# Altium schematic sheet Power.SchDoc: Projekt DAC AUPSC 2019
size A4; Date: 4.10.2019; Author: Michal Grzegorzek; SheetNumber: 4; SheetTotal: 4; Model: EM1; PageSetup: Record=PageOptions|CenterHorizontal=True|CenterVertical=True|PrintScale=0.52|XCorrection=1.00|YCorrection=1.00|PrintKind=1|BorderSize=5000000|LeftOffset=0|BottomOffset=0|Orientation=2|PaperLength=4200|PaperWidth=2970|Scale=100|PaperSource=7|PrintQuality=600|MediaType=1|DitherType=10|PaperKind=A3|PrintScaleMode=1
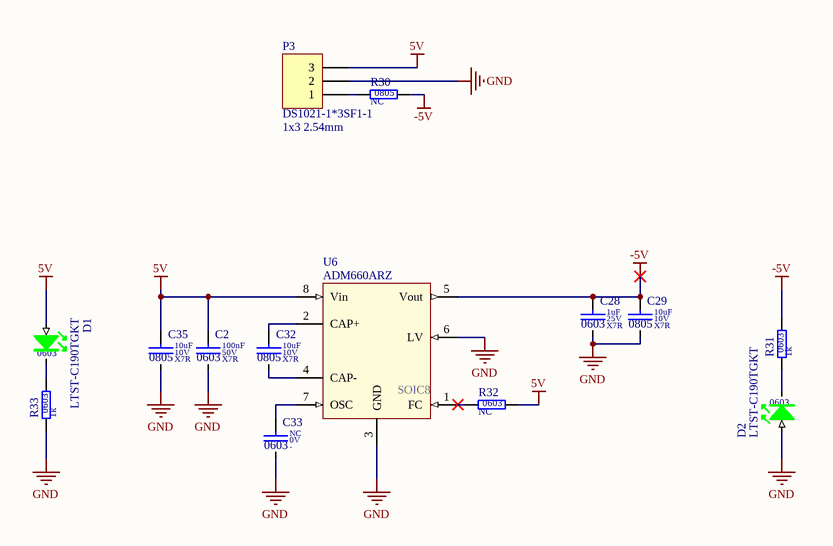
[diagram p0: Power.SchDoc]

## Parts
C2  value 100nF  Dielectric: X7R  Voltage: 50V  SCH_Footprint: 0603  [C_0603_1608]  (hidden comment: Ceramic X7R)
C28  value 1uF  Dielectric: X7R  Voltage: 25V  SCH_Footprint: 0603  [C_0603_1608]  (hidden comment: Ceramic X7R)
C29  value 10uF  Dielectric: X7R  Voltage: 10V  SCH_Footprint: 0805  [C_0805_2012]  (hidden comment: Ceramic X7R)
C32  value 10uF  Dielectric: X7R  Voltage: 10V  SCH_Footprint: 0805  [C_0805_2012]  (hidden comment: Ceramic X7R)
C33  value NC  Voltage: 0V  SCH_Footprint: 0603  [C_NC_0603_1608]  (hidden comment: -)
C35  value 10uF  Dielectric: X7R  Voltage: 10V  SCH_Footprint: 0805  [C_0805_2012]  (hidden comment: Ceramic X7R)
D1  value LTST-C190TGKT  SCH_Footprint: 0603  [OL_0603_1608]  (hidden comment: Green Led)
D2  value LTST-C190TGKT  SCH_Footprint: 0603  [OL_0603_1608]  (hidden comment: Green Led)
P3  value DS1021-1*3SF1-1  SCH_Footprint: 1x3 2.54mm  [P_HEADER_1x3_2.54]  (hidden comment: Goldpin)
R30  value NC  SCH_Footprint: 0805  [R_NC_0805_2012]  (hidden comment: Resistor)
R31  value 1k  SCH_Footprint: 0603  [R_0603_1608]  (hidden comment: Resistor)
R32  value NC  SCH_Footprint: 0603  [R_NC_0603_1608]  (hidden comment: Resistor)
R33  value 1k  SCH_Footprint: 0603  [R_0603_1608]  (hidden comment: Resistor)
U6  value ADM660ARZ  SCH_Footprint: SOIC8  [SOP8_SO8_SOIC8_4X5X18]  (hidden comment: ADM660)

## Nets
5V: C2.1 C35.1 D1.2(A) P3.3 R32.2 U6.8(Vin)
-5V: C28.1 C29.1 R30.2 R31.2 U6.5(Vout)
GND: C2.2 C28.2 C29.2 C33.2 C35.2 D2.2(A) P3.2 R33.1 U6.3(GND) U6.6(LV)
NetC32_1: C32.1 U6.2(CAP+)
NetC32_2: C32.2 U6.4(CAP-)
NetC33_1: C33.1 U6.7(OSC)
NetD1_1: D1.1(K) R33.2
NetD2_1: D2.1(K) R31.1
NetP3_1: P3.1 R30.1
NetR32_1: R32.1 U6.1(FC)

## Notes on the sheet
- Title:
- Sheet:
- of
- Author:
- Model:
- Document Number:
- Checked by:
- Iss-Rev:
- Approved by:
- Date:
- File name:

## Library data of the parts
C2 = C_100nF_50V_X7R_0603_5: Capacitor; Manufacturer: Samsung; Manufacturer Part Number: CL10B104JB8NNNC; Tolerance (%): 5; Part Number: C_100nF_50V_X7R_0603_5; HelpURL: http://www.tme.eu/pl/Document/4a42202b32dab16128fe107dd69598cc/samsung-chip-cap.pdf; Supplier 1: TME; Supplier Part Number 1: CL10B104JB8NNNC; Supplier 2: RS Components; Supplier 3: Farnell; Supplier 4: Mouser; Supplier 5: Digi-Key
C28 = C_1uF_25V_X7R_0603_10: Capacitor; Manufacturer: Samsung; Manufacturer Part Number: CL10B105KA8NNNC; Tolerance (%): 10; Part Number: C_1uF_25V_X7R_0603_10; HelpURL: http://www.tme.eu/pl/Document/4a42202b32dab16128fe107dd69598cc/samsung-chip-cap.pdf; Supplier 1: TME; Supplier Part Number 1: CL10B105KA8NNNC; Supplier 2: RS Components; Supplier 3: Farnell; Supplier 4: Mouser; Supplier 5: Digi-Key
C29 C32 C35 = C_10uF_10V_X7R_0805_10: Capacitor; Manufacturer: Samsung Electro-Mechanics; Manufacturer Part Number: CL21B106KPQNNNG; Tolerance (%): 10; Part Number: C_10uF_10V_X7R_0805_10; HelpURL: http://www.tme.eu/pl/Document/4a42202b32dab16128fe107dd69598cc/samsung-chip-cap.pdf; Supplier 1: TME; Supplier Part Number 1: CL21B106KPQNNNG; Supplier 2: RS Components; Supplier 3: Farnell; Supplier 4: Mouser; Supplier 5: Digi-Key
C33 = C_GENERIC_0603: Capacitor; Tolerance (%): 0; Dielectric: -; Part Number: C_GENERIC_0603; HelpURL: http://-; Manufacturer: -; Manufacturer Part Number: -; Supplier 1: TME; Supplier 2: RS Components; Supplier 3: Farnell; Supplier 4: Mouser; Supplier 5: Digi-Key
D1 D2 = OL_G_0603: LED GREEN; Manufacturer: Lite-On; Part Number: OL_G_0603; HelpURL: https://datasheet.octopart.com/LTST-C190TGKT-Lite-On-datasheet-158437.pdf; Manufacturer Part Number: LTST-C190TGKT; Supplier 1: TME; Supplier Part Number 1: LTST-C190TGKT; Supplier 2: RS Components; Supplier Part Number 2: 6920997P; Supplier 3: Farnell; Supplier 4: Mouser; Supplier Part Number 4: 859-LTST-C190TGKT; Supplier 5: Digi-Key; Supplier Part Number 5: 160-2019-1-ND
P3 = P_HEADER_1x3_2.54: Header, 3-Pin; Manufacturer: Connfly; Part Number: P_HEADER_1x3_2.54; Component Type: Standard; HelpURL: http://www.tme.eu/en/Document/cc301e58a5da78cb543a94b5a5b7f06a/DS1021.pdf; Manufacturer Part Number: DS1021-1*3SF1-1; Supplier 1: TME; Supplier Part Number 1: ZL201-03G; Supplier 2: RS Components; Supplier 3: Farnell; Supplier 4: Mouser; Supplier 5: Digi-Key
R30 = R_GENERIC_0805: Part Number: R_GENERIC_0805; Supplier 1: TME; Supplier 2: RS Components; Supplier 3: Farnell; Supplier 4: Mouser; Supplier 5: Digi-Key
R31 R33 = R_1k_0603_1: Manufacturer: Vishay; Manufacturer Part Number: CRCW06031K00FKEA; Voltage: 75V; Power: 100mW; Tolerance: 1%; Part Number: R_1k_0603_1; HelpURL: http://www.farnell.com/datasheets/2310790.pdf?_ga=2.256888843.1690599162.1548417389-1379097396.1542296996&_gac=1.262631934.1547230258.Cj0KCQiAmuHhBRD0ARIsAFWyPwhX8HcvXnM3tA0ZBodZLzDIjH2ZxLpjT5LWo9bad_HPRbU8LfPq44UaAhEwEALw_wcB; Supplier 1: TME; Supplier 2: RS Components; Supplier Part Number 2: 678-9875P; Supplier 3: Farnell; Supplier Part Number 3: 1469740; Supplier 4: Mouser; Supplier Part Number 4: 71-CRCW0603-1.0K-E3; Supplier 5: Digi-Key; Supplier Part Number 5: 541-1.00KHCT-ND
R32 = R_GENERIC_0603: Part Number: R_GENERIC_0603; Supplier 1: TME; Supplier 2: RS Components; Supplier 3: Farnell; Supplier 4: Mouser; Supplier 5: Digi-Key
U6 = VS_ADM660ARZ: Manufacturer: Analog Devices; Frequency (kHz): 25; Topology: Other; Vin min (V): 1,5; Vin max (V): 7; Vout min (V): -7; Vout max (V): -1,5; Imax (A): 0,1; Iswitch (A): 0; Part Number: VS_ADM660ARZ; HelpURL: https://www.analog.com/media/en/technical-documentation/data-sheets/ADM660_8660.pdf; Manufacturer Part Number: ADM660ARZ; Supplier 1: TME; Supplier 2: RS Components; Supplier 3: Farnell; Supplier Part Number 3: 1661070; Supplier 4: Mouser; Supplier Part Number 4: 584-ADM660ARZ; Supplier 5: Digi-Key; Supplier Part Number 5: ADM660ARZ-ND